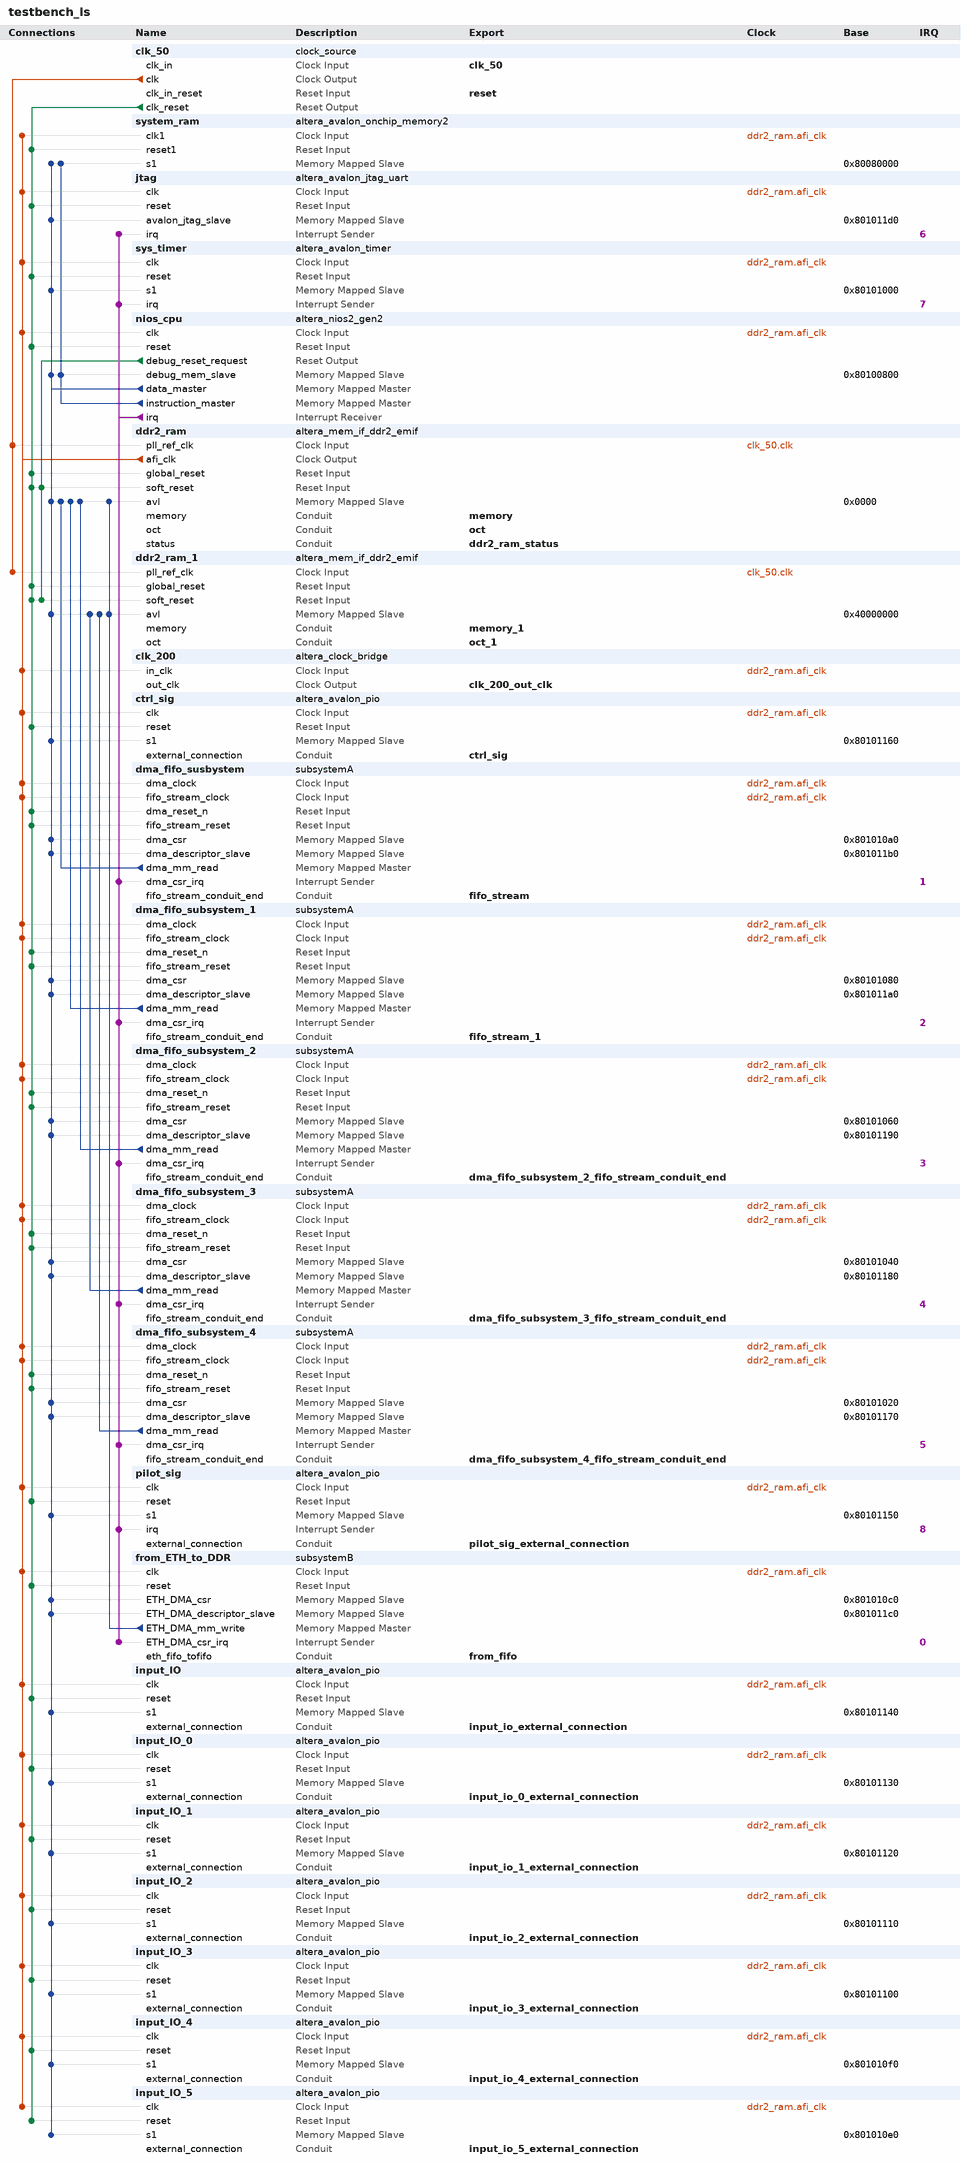
[diagram p0: system contents]
# Platform Designer (Qsys) system testbench_ls, Stratix IV EP4SGX530KH40C2
# Parameters at their usual value, and those the tool derives, are not listed.
package require -exact qsys 18.1
create_system testbench_ls
set_project_property DEVICE_FAMILY {Stratix IV}
set_project_property DEVICE EP4SGX530KH40C2

add_instance clk_50 clock_source 18.1
set_instance_parameter_value clk_50 clockFrequency 50000000

add_instance system_ram altera_avalon_onchip_memory2 18.1
set_instance_parameter_value system_ram blockType M9K
set_instance_parameter_value system_ram dataWidth 32
set_instance_parameter_value system_ram dualPort false
set_instance_parameter_value system_ram initMemContent true
set_instance_parameter_value system_ram initializationFileName onchip_mem.hex
set_instance_parameter_value system_ram memorySize 512000

add_instance jtag altera_avalon_jtag_uart 18.1
set_instance_parameter_value jtag simInteractiveOptions NO_INTERACTIVE_WINDOWS

add_instance sys_timer altera_avalon_timer 18.1
set_instance_parameter_value sys_timer period 1
set_instance_parameter_value sys_timer periodUnits MSEC

add_instance nios_cpu altera_nios2_gen2 18.1
set_instance_parameter_value nios_cpu dcache_size 2048
set_instance_parameter_value nios_cpu exceptionSlave system_ram.s1
set_instance_parameter_value nios_cpu icache_size 4096
set_instance_parameter_value nios_cpu impl Fast
set_instance_parameter_value nios_cpu resetSlave system_ram.s1
set_instance_parameter_value nios_cpu setting_support31bitdcachebypass false

add_instance ddr2_ram altera_mem_if_ddr2_emif 18.1
set_instance_parameter_value ddr2_ram AVL_MAX_SIZE 4
set_instance_parameter_value ddr2_ram CALIBRATION_MODE Skip
set_instance_parameter_value ddr2_ram DLL_SHARING_MODE None
set_instance_parameter_value ddr2_ram EXPORT_AFI_HALF_CLK false
set_instance_parameter_value ddr2_ram MEM_BANKADDR_WIDTH 3
set_instance_parameter_value ddr2_ram MEM_CLK_FREQ 400.0
set_instance_parameter_value ddr2_ram MEM_COL_ADDR_WIDTH 10
set_instance_parameter_value ddr2_ram MEM_DQ_WIDTH 64
set_instance_parameter_value ddr2_ram MEM_NUMBER_OF_RANKS_PER_DIMM 1
set_instance_parameter_value ddr2_ram MEM_ROW_ADDR_WIDTH 14
set_instance_parameter_value ddr2_ram MEM_TCL 6
set_instance_parameter_value ddr2_ram MEM_TRAS_NS 40.0
set_instance_parameter_value ddr2_ram PLL_SHARING_MODE None
set_instance_parameter_value ddr2_ram POWER_OF_TWO_BUS false
set_instance_parameter_value ddr2_ram REF_CLK_FREQ 50.0
set_instance_parameter_value ddr2_ram TIMING_TDQSQ 200
set_instance_parameter_value ddr2_ram TIMING_TIH 370
set_instance_parameter_value ddr2_ram TIMING_TQHS 300
set_instance_parameter_value ddr2_ram USER_DEBUG_LEVEL 1

add_instance ddr2_ram_1 altera_mem_if_ddr2_emif 18.1
set_instance_parameter_value ddr2_ram_1 AVL_MAX_SIZE 4
set_instance_parameter_value ddr2_ram_1 CALIBRATION_MODE Skip
set_instance_parameter_value ddr2_ram_1 DLL_SHARING_MODE None
set_instance_parameter_value ddr2_ram_1 EXPORT_AFI_HALF_CLK false
set_instance_parameter_value ddr2_ram_1 MEM_BANKADDR_WIDTH 3
set_instance_parameter_value ddr2_ram_1 MEM_CLK_FREQ 400.0
set_instance_parameter_value ddr2_ram_1 MEM_COL_ADDR_WIDTH 10
set_instance_parameter_value ddr2_ram_1 MEM_DQ_WIDTH 64
set_instance_parameter_value ddr2_ram_1 MEM_NUMBER_OF_RANKS_PER_DIMM 1
set_instance_parameter_value ddr2_ram_1 MEM_ROW_ADDR_WIDTH 14
set_instance_parameter_value ddr2_ram_1 MEM_TCL 6
set_instance_parameter_value ddr2_ram_1 MEM_TRAS_NS 40.0
set_instance_parameter_value ddr2_ram_1 PLL_SHARING_MODE None
set_instance_parameter_value ddr2_ram_1 POWER_OF_TWO_BUS false
set_instance_parameter_value ddr2_ram_1 REF_CLK_FREQ 50.0
set_instance_parameter_value ddr2_ram_1 TIMING_TDQSQ 200
set_instance_parameter_value ddr2_ram_1 TIMING_TIH 370
set_instance_parameter_value ddr2_ram_1 TIMING_TQHS 300
set_instance_parameter_value ddr2_ram_1 USER_DEBUG_LEVEL 1

add_instance clk_200 altera_clock_bridge 18.1
set_instance_parameter_value clk_200 DERIVED_CLOCK_RATE 200000000
set_instance_parameter_value clk_200 EXPLICIT_CLOCK_RATE 0

add_instance ctrl_sig altera_avalon_pio 18.1
set_instance_parameter_value ctrl_sig direction Output
set_instance_parameter_value ctrl_sig width 4

add_instance dma_fifo_susbystem subsystemA 1.0

add_instance dma_fifo_subsystem_1 subsystemA 1.0

add_instance dma_fifo_subsystem_2 subsystemA 1.0

add_instance dma_fifo_subsystem_3 subsystemA 1.0

add_instance dma_fifo_subsystem_4 subsystemA 1.0

add_instance pilot_sig altera_avalon_pio 18.1
set_instance_parameter_value pilot_sig bitClearingEdgeCapReg true
set_instance_parameter_value pilot_sig captureEdge true
set_instance_parameter_value pilot_sig direction Input
set_instance_parameter_value pilot_sig generateIRQ true
set_instance_parameter_value pilot_sig irqType EDGE
set_instance_parameter_value pilot_sig width 8

add_instance from_ETH_to_DDR subsystemB 1.0

add_instance input_IO altera_avalon_pio 18.1
set_instance_parameter_value input_IO bitClearingEdgeCapReg true
set_instance_parameter_value input_IO captureEdge true
set_instance_parameter_value input_IO direction Input
set_instance_parameter_value input_IO width 16

add_instance input_IO_0 altera_avalon_pio 18.1
set_instance_parameter_value input_IO_0 bitClearingEdgeCapReg true
set_instance_parameter_value input_IO_0 captureEdge true
set_instance_parameter_value input_IO_0 direction Input
set_instance_parameter_value input_IO_0 width 16

add_instance input_IO_1 altera_avalon_pio 18.1
set_instance_parameter_value input_IO_1 bitClearingEdgeCapReg true
set_instance_parameter_value input_IO_1 captureEdge true
set_instance_parameter_value input_IO_1 direction Input
set_instance_parameter_value input_IO_1 width 16

add_instance input_IO_2 altera_avalon_pio 18.1
set_instance_parameter_value input_IO_2 bitClearingEdgeCapReg true
set_instance_parameter_value input_IO_2 captureEdge true
set_instance_parameter_value input_IO_2 direction Input
set_instance_parameter_value input_IO_2 width 16

add_instance input_IO_3 altera_avalon_pio 18.1
set_instance_parameter_value input_IO_3 bitClearingEdgeCapReg true
set_instance_parameter_value input_IO_3 captureEdge true
set_instance_parameter_value input_IO_3 direction Input
set_instance_parameter_value input_IO_3 width 16

add_instance input_IO_4 altera_avalon_pio 18.1
set_instance_parameter_value input_IO_4 bitClearingEdgeCapReg true
set_instance_parameter_value input_IO_4 captureEdge true
set_instance_parameter_value input_IO_4 direction Input
set_instance_parameter_value input_IO_4 width 16

add_instance input_IO_5 altera_avalon_pio 18.1
set_instance_parameter_value input_IO_5 bitClearingEdgeCapReg true
set_instance_parameter_value input_IO_5 captureEdge true
set_instance_parameter_value input_IO_5 direction Input
set_instance_parameter_value input_IO_5 width 8

# connections
add_connection clk_50.clk ddr2_ram.pll_ref_clk clock
add_connection clk_50.clk ddr2_ram_1.pll_ref_clk clock
add_connection ddr2_ram.afi_clk clk_200.in_clk clock
add_connection ddr2_ram.afi_clk ctrl_sig.clk clock
add_connection ddr2_ram.afi_clk dma_fifo_subsystem_1.dma_clock clock
add_connection ddr2_ram.afi_clk dma_fifo_subsystem_1.fifo_stream_clock clock
add_connection ddr2_ram.afi_clk dma_fifo_subsystem_2.dma_clock clock
add_connection ddr2_ram.afi_clk dma_fifo_subsystem_2.fifo_stream_clock clock
add_connection ddr2_ram.afi_clk dma_fifo_subsystem_3.dma_clock clock
add_connection ddr2_ram.afi_clk dma_fifo_subsystem_3.fifo_stream_clock clock
add_connection ddr2_ram.afi_clk dma_fifo_subsystem_4.dma_clock clock
add_connection ddr2_ram.afi_clk dma_fifo_subsystem_4.fifo_stream_clock clock
add_connection ddr2_ram.afi_clk dma_fifo_susbystem.dma_clock clock
add_connection ddr2_ram.afi_clk dma_fifo_susbystem.fifo_stream_clock clock
add_connection ddr2_ram.afi_clk from_ETH_to_DDR.clk clock
add_connection ddr2_ram.afi_clk input_IO.clk clock
add_connection ddr2_ram.afi_clk input_IO_0.clk clock
add_connection ddr2_ram.afi_clk input_IO_1.clk clock
add_connection ddr2_ram.afi_clk input_IO_2.clk clock
add_connection ddr2_ram.afi_clk input_IO_3.clk clock
add_connection ddr2_ram.afi_clk input_IO_4.clk clock
add_connection ddr2_ram.afi_clk input_IO_5.clk clock
add_connection ddr2_ram.afi_clk jtag.clk clock
add_connection ddr2_ram.afi_clk nios_cpu.clk clock
add_connection ddr2_ram.afi_clk pilot_sig.clk clock
add_connection ddr2_ram.afi_clk sys_timer.clk clock
add_connection ddr2_ram.afi_clk system_ram.clk1 clock
add_connection clk_50.clk_reset ctrl_sig.reset reset
add_connection clk_50.clk_reset ddr2_ram.global_reset reset
add_connection clk_50.clk_reset ddr2_ram.soft_reset reset
add_connection clk_50.clk_reset ddr2_ram_1.global_reset reset
add_connection clk_50.clk_reset ddr2_ram_1.soft_reset reset
add_connection clk_50.clk_reset dma_fifo_subsystem_1.dma_reset_n reset
add_connection clk_50.clk_reset dma_fifo_subsystem_1.fifo_stream_reset reset
add_connection clk_50.clk_reset dma_fifo_subsystem_2.dma_reset_n reset
add_connection clk_50.clk_reset dma_fifo_subsystem_2.fifo_stream_reset reset
add_connection clk_50.clk_reset dma_fifo_subsystem_3.dma_reset_n reset
add_connection clk_50.clk_reset dma_fifo_subsystem_3.fifo_stream_reset reset
add_connection clk_50.clk_reset dma_fifo_subsystem_4.dma_reset_n reset
add_connection clk_50.clk_reset dma_fifo_subsystem_4.fifo_stream_reset reset
add_connection clk_50.clk_reset dma_fifo_susbystem.dma_reset_n reset
add_connection clk_50.clk_reset dma_fifo_susbystem.fifo_stream_reset reset
add_connection clk_50.clk_reset from_ETH_to_DDR.reset reset
add_connection clk_50.clk_reset input_IO.reset reset
add_connection clk_50.clk_reset input_IO_0.reset reset
add_connection clk_50.clk_reset input_IO_1.reset reset
add_connection clk_50.clk_reset input_IO_2.reset reset
add_connection clk_50.clk_reset input_IO_3.reset reset
add_connection clk_50.clk_reset input_IO_4.reset reset
add_connection clk_50.clk_reset input_IO_5.reset reset
add_connection clk_50.clk_reset jtag.reset reset
add_connection clk_50.clk_reset nios_cpu.reset reset
add_connection clk_50.clk_reset pilot_sig.reset reset
add_connection clk_50.clk_reset sys_timer.reset reset
add_connection clk_50.clk_reset system_ram.reset1 reset
add_connection nios_cpu.debug_reset_request ddr2_ram.soft_reset reset
add_connection nios_cpu.debug_reset_request ddr2_ram_1.soft_reset reset
add_connection dma_fifo_subsystem_1.dma_mm_read ddr2_ram.avl avalon
set_connection_parameter_value dma_fifo_subsystem_1.dma_mm_read/ddr2_ram.avl baseAddress 0x0000
add_connection dma_fifo_subsystem_2.dma_mm_read ddr2_ram.avl avalon
set_connection_parameter_value dma_fifo_subsystem_2.dma_mm_read/ddr2_ram.avl baseAddress 0x0000
add_connection dma_fifo_subsystem_3.dma_mm_read ddr2_ram_1.avl avalon
set_connection_parameter_value dma_fifo_subsystem_3.dma_mm_read/ddr2_ram_1.avl baseAddress 0x40000000
add_connection dma_fifo_subsystem_4.dma_mm_read ddr2_ram_1.avl avalon
set_connection_parameter_value dma_fifo_subsystem_4.dma_mm_read/ddr2_ram_1.avl baseAddress 0x40000000
add_connection dma_fifo_susbystem.dma_mm_read ddr2_ram.avl avalon
set_connection_parameter_value dma_fifo_susbystem.dma_mm_read/ddr2_ram.avl baseAddress 0x0000
add_connection from_ETH_to_DDR.ETH_DMA_mm_write ddr2_ram.avl avalon
set_connection_parameter_value from_ETH_to_DDR.ETH_DMA_mm_write/ddr2_ram.avl baseAddress 0x0000
add_connection from_ETH_to_DDR.ETH_DMA_mm_write ddr2_ram_1.avl avalon
set_connection_parameter_value from_ETH_to_DDR.ETH_DMA_mm_write/ddr2_ram_1.avl baseAddress 0x40000000
add_connection nios_cpu.data_master ctrl_sig.s1 avalon
set_connection_parameter_value nios_cpu.data_master/ctrl_sig.s1 baseAddress 0x80101160
add_connection nios_cpu.data_master ddr2_ram.avl avalon
set_connection_parameter_value nios_cpu.data_master/ddr2_ram.avl baseAddress 0x0000
add_connection nios_cpu.data_master ddr2_ram_1.avl avalon
set_connection_parameter_value nios_cpu.data_master/ddr2_ram_1.avl baseAddress 0x40000000
add_connection nios_cpu.data_master dma_fifo_subsystem_1.dma_csr avalon
set_connection_parameter_value nios_cpu.data_master/dma_fifo_subsystem_1.dma_csr baseAddress 0x80101080
add_connection nios_cpu.data_master dma_fifo_subsystem_1.dma_descriptor_slave avalon
set_connection_parameter_value nios_cpu.data_master/dma_fifo_subsystem_1.dma_descriptor_slave baseAddress 0x801011a0
add_connection nios_cpu.data_master dma_fifo_subsystem_2.dma_csr avalon
set_connection_parameter_value nios_cpu.data_master/dma_fifo_subsystem_2.dma_csr baseAddress 0x80101060
add_connection nios_cpu.data_master dma_fifo_subsystem_2.dma_descriptor_slave avalon
set_connection_parameter_value nios_cpu.data_master/dma_fifo_subsystem_2.dma_descriptor_slave baseAddress 0x80101190
add_connection nios_cpu.data_master dma_fifo_subsystem_3.dma_csr avalon
set_connection_parameter_value nios_cpu.data_master/dma_fifo_subsystem_3.dma_csr baseAddress 0x80101040
add_connection nios_cpu.data_master dma_fifo_subsystem_3.dma_descriptor_slave avalon
set_connection_parameter_value nios_cpu.data_master/dma_fifo_subsystem_3.dma_descriptor_slave baseAddress 0x80101180
add_connection nios_cpu.data_master dma_fifo_subsystem_4.dma_csr avalon
set_connection_parameter_value nios_cpu.data_master/dma_fifo_subsystem_4.dma_csr baseAddress 0x80101020
add_connection nios_cpu.data_master dma_fifo_subsystem_4.dma_descriptor_slave avalon
set_connection_parameter_value nios_cpu.data_master/dma_fifo_subsystem_4.dma_descriptor_slave baseAddress 0x80101170
add_connection nios_cpu.data_master dma_fifo_susbystem.dma_csr avalon
set_connection_parameter_value nios_cpu.data_master/dma_fifo_susbystem.dma_csr baseAddress 0x801010a0
add_connection nios_cpu.data_master dma_fifo_susbystem.dma_descriptor_slave avalon
set_connection_parameter_value nios_cpu.data_master/dma_fifo_susbystem.dma_descriptor_slave baseAddress 0x801011b0
add_connection nios_cpu.data_master from_ETH_to_DDR.ETH_DMA_csr avalon
set_connection_parameter_value nios_cpu.data_master/from_ETH_to_DDR.ETH_DMA_csr baseAddress 0x801010c0
add_connection nios_cpu.data_master from_ETH_to_DDR.ETH_DMA_descriptor_slave avalon
set_connection_parameter_value nios_cpu.data_master/from_ETH_to_DDR.ETH_DMA_descriptor_slave baseAddress 0x801011c0
add_connection nios_cpu.data_master input_IO.s1 avalon
set_connection_parameter_value nios_cpu.data_master/input_IO.s1 baseAddress 0x80101140
add_connection nios_cpu.data_master input_IO_0.s1 avalon
set_connection_parameter_value nios_cpu.data_master/input_IO_0.s1 baseAddress 0x80101130
add_connection nios_cpu.data_master input_IO_1.s1 avalon
set_connection_parameter_value nios_cpu.data_master/input_IO_1.s1 baseAddress 0x80101120
add_connection nios_cpu.data_master input_IO_2.s1 avalon
set_connection_parameter_value nios_cpu.data_master/input_IO_2.s1 baseAddress 0x80101110
add_connection nios_cpu.data_master input_IO_3.s1 avalon
set_connection_parameter_value nios_cpu.data_master/input_IO_3.s1 baseAddress 0x80101100
add_connection nios_cpu.data_master input_IO_4.s1 avalon
set_connection_parameter_value nios_cpu.data_master/input_IO_4.s1 baseAddress 0x801010f0
add_connection nios_cpu.data_master input_IO_5.s1 avalon
set_connection_parameter_value nios_cpu.data_master/input_IO_5.s1 baseAddress 0x801010e0
add_connection nios_cpu.data_master jtag.avalon_jtag_slave avalon
set_connection_parameter_value nios_cpu.data_master/jtag.avalon_jtag_slave baseAddress 0x801011d0
add_connection nios_cpu.data_master nios_cpu.debug_mem_slave avalon
set_connection_parameter_value nios_cpu.data_master/nios_cpu.debug_mem_slave baseAddress 0x80100800
add_connection nios_cpu.data_master pilot_sig.s1 avalon
set_connection_parameter_value nios_cpu.data_master/pilot_sig.s1 baseAddress 0x80101150
add_connection nios_cpu.data_master sys_timer.s1 avalon
set_connection_parameter_value nios_cpu.data_master/sys_timer.s1 baseAddress 0x80101000
add_connection nios_cpu.data_master system_ram.s1 avalon
set_connection_parameter_value nios_cpu.data_master/system_ram.s1 baseAddress 0x80080000
add_connection nios_cpu.instruction_master nios_cpu.debug_mem_slave avalon
set_connection_parameter_value nios_cpu.instruction_master/nios_cpu.debug_mem_slave baseAddress 0x80100800
add_connection nios_cpu.instruction_master system_ram.s1 avalon
set_connection_parameter_value nios_cpu.instruction_master/system_ram.s1 baseAddress 0x80080000
add_connection nios_cpu.irq dma_fifo_subsystem_1.dma_csr_irq interrupt
set_connection_parameter_value nios_cpu.irq/dma_fifo_subsystem_1.dma_csr_irq irqNumber 2
add_connection nios_cpu.irq dma_fifo_subsystem_2.dma_csr_irq interrupt
set_connection_parameter_value nios_cpu.irq/dma_fifo_subsystem_2.dma_csr_irq irqNumber 3
add_connection nios_cpu.irq dma_fifo_subsystem_3.dma_csr_irq interrupt
set_connection_parameter_value nios_cpu.irq/dma_fifo_subsystem_3.dma_csr_irq irqNumber 4
add_connection nios_cpu.irq dma_fifo_subsystem_4.dma_csr_irq interrupt
set_connection_parameter_value nios_cpu.irq/dma_fifo_subsystem_4.dma_csr_irq irqNumber 5
add_connection nios_cpu.irq dma_fifo_susbystem.dma_csr_irq interrupt
set_connection_parameter_value nios_cpu.irq/dma_fifo_susbystem.dma_csr_irq irqNumber 1
add_connection nios_cpu.irq from_ETH_to_DDR.ETH_DMA_csr_irq interrupt
set_connection_parameter_value nios_cpu.irq/from_ETH_to_DDR.ETH_DMA_csr_irq irqNumber 0
add_connection nios_cpu.irq jtag.irq interrupt
set_connection_parameter_value nios_cpu.irq/jtag.irq irqNumber 6
add_connection nios_cpu.irq pilot_sig.irq interrupt
set_connection_parameter_value nios_cpu.irq/pilot_sig.irq irqNumber 8
add_connection nios_cpu.irq sys_timer.irq interrupt
set_connection_parameter_value nios_cpu.irq/sys_timer.irq irqNumber 7

# exported interfaces
add_interface clk_200_out_clk clock source
set_interface_property clk_200_out_clk EXPORT_OF clk_200.out_clk
add_interface clk_50 clock sink
set_interface_property clk_50 EXPORT_OF clk_50.clk_in
add_interface ctrl_sig conduit end
set_interface_property ctrl_sig EXPORT_OF ctrl_sig.external_connection
add_interface ddr2_ram_status conduit end
set_interface_property ddr2_ram_status EXPORT_OF ddr2_ram.status
add_interface dma_fifo_subsystem_2_fifo_stream_conduit_end conduit end
set_interface_property dma_fifo_subsystem_2_fifo_stream_conduit_end EXPORT_OF dma_fifo_subsystem_2.fifo_stream_conduit_end
add_interface dma_fifo_subsystem_3_fifo_stream_conduit_end conduit end
set_interface_property dma_fifo_subsystem_3_fifo_stream_conduit_end EXPORT_OF dma_fifo_subsystem_3.fifo_stream_conduit_end
add_interface dma_fifo_subsystem_4_fifo_stream_conduit_end conduit end
set_interface_property dma_fifo_subsystem_4_fifo_stream_conduit_end EXPORT_OF dma_fifo_subsystem_4.fifo_stream_conduit_end
add_interface fifo_stream conduit end
set_interface_property fifo_stream EXPORT_OF dma_fifo_susbystem.fifo_stream_conduit_end
add_interface fifo_stream_1 conduit end
set_interface_property fifo_stream_1 EXPORT_OF dma_fifo_subsystem_1.fifo_stream_conduit_end
add_interface from_fifo conduit end
set_interface_property from_fifo EXPORT_OF from_ETH_to_DDR.eth_fifo_tofifo
add_interface input_io_0_external_connection conduit end
set_interface_property input_io_0_external_connection EXPORT_OF input_IO_0.external_connection
add_interface input_io_1_external_connection conduit end
set_interface_property input_io_1_external_connection EXPORT_OF input_IO_1.external_connection
add_interface input_io_2_external_connection conduit end
set_interface_property input_io_2_external_connection EXPORT_OF input_IO_2.external_connection
add_interface input_io_3_external_connection conduit end
set_interface_property input_io_3_external_connection EXPORT_OF input_IO_3.external_connection
add_interface input_io_4_external_connection conduit end
set_interface_property input_io_4_external_connection EXPORT_OF input_IO_4.external_connection
add_interface input_io_5_external_connection conduit end
set_interface_property input_io_5_external_connection EXPORT_OF input_IO_5.external_connection
add_interface input_io_external_connection conduit end
set_interface_property input_io_external_connection EXPORT_OF input_IO.external_connection
add_interface memory conduit end
set_interface_property memory EXPORT_OF ddr2_ram.memory
add_interface memory_1 conduit end
set_interface_property memory_1 EXPORT_OF ddr2_ram_1.memory
add_interface oct conduit end
set_interface_property oct EXPORT_OF ddr2_ram.oct
add_interface oct_1 conduit end
set_interface_property oct_1 EXPORT_OF ddr2_ram_1.oct
add_interface pilot_sig_external_connection conduit end
set_interface_property pilot_sig_external_connection EXPORT_OF pilot_sig.external_connection
add_interface reset reset sink
set_interface_property reset EXPORT_OF clk_50.clk_in_reset

set_interconnect_requirement {$system} qsys_mm.clockCrossingAdapter HANDSHAKE
set_interconnect_requirement {$system} qsys_mm.enableEccProtection FALSE
set_interconnect_requirement {$system} qsys_mm.insertDefaultSlave FALSE
set_interconnect_requirement {$system} qsys_mm.maxAdditionalLatency 1

save_system testbench_ls.qsys
